# Altium schematic sheet Sheet1.SchDoc
size C; SheetNumber: 1; SheetTotal: 1
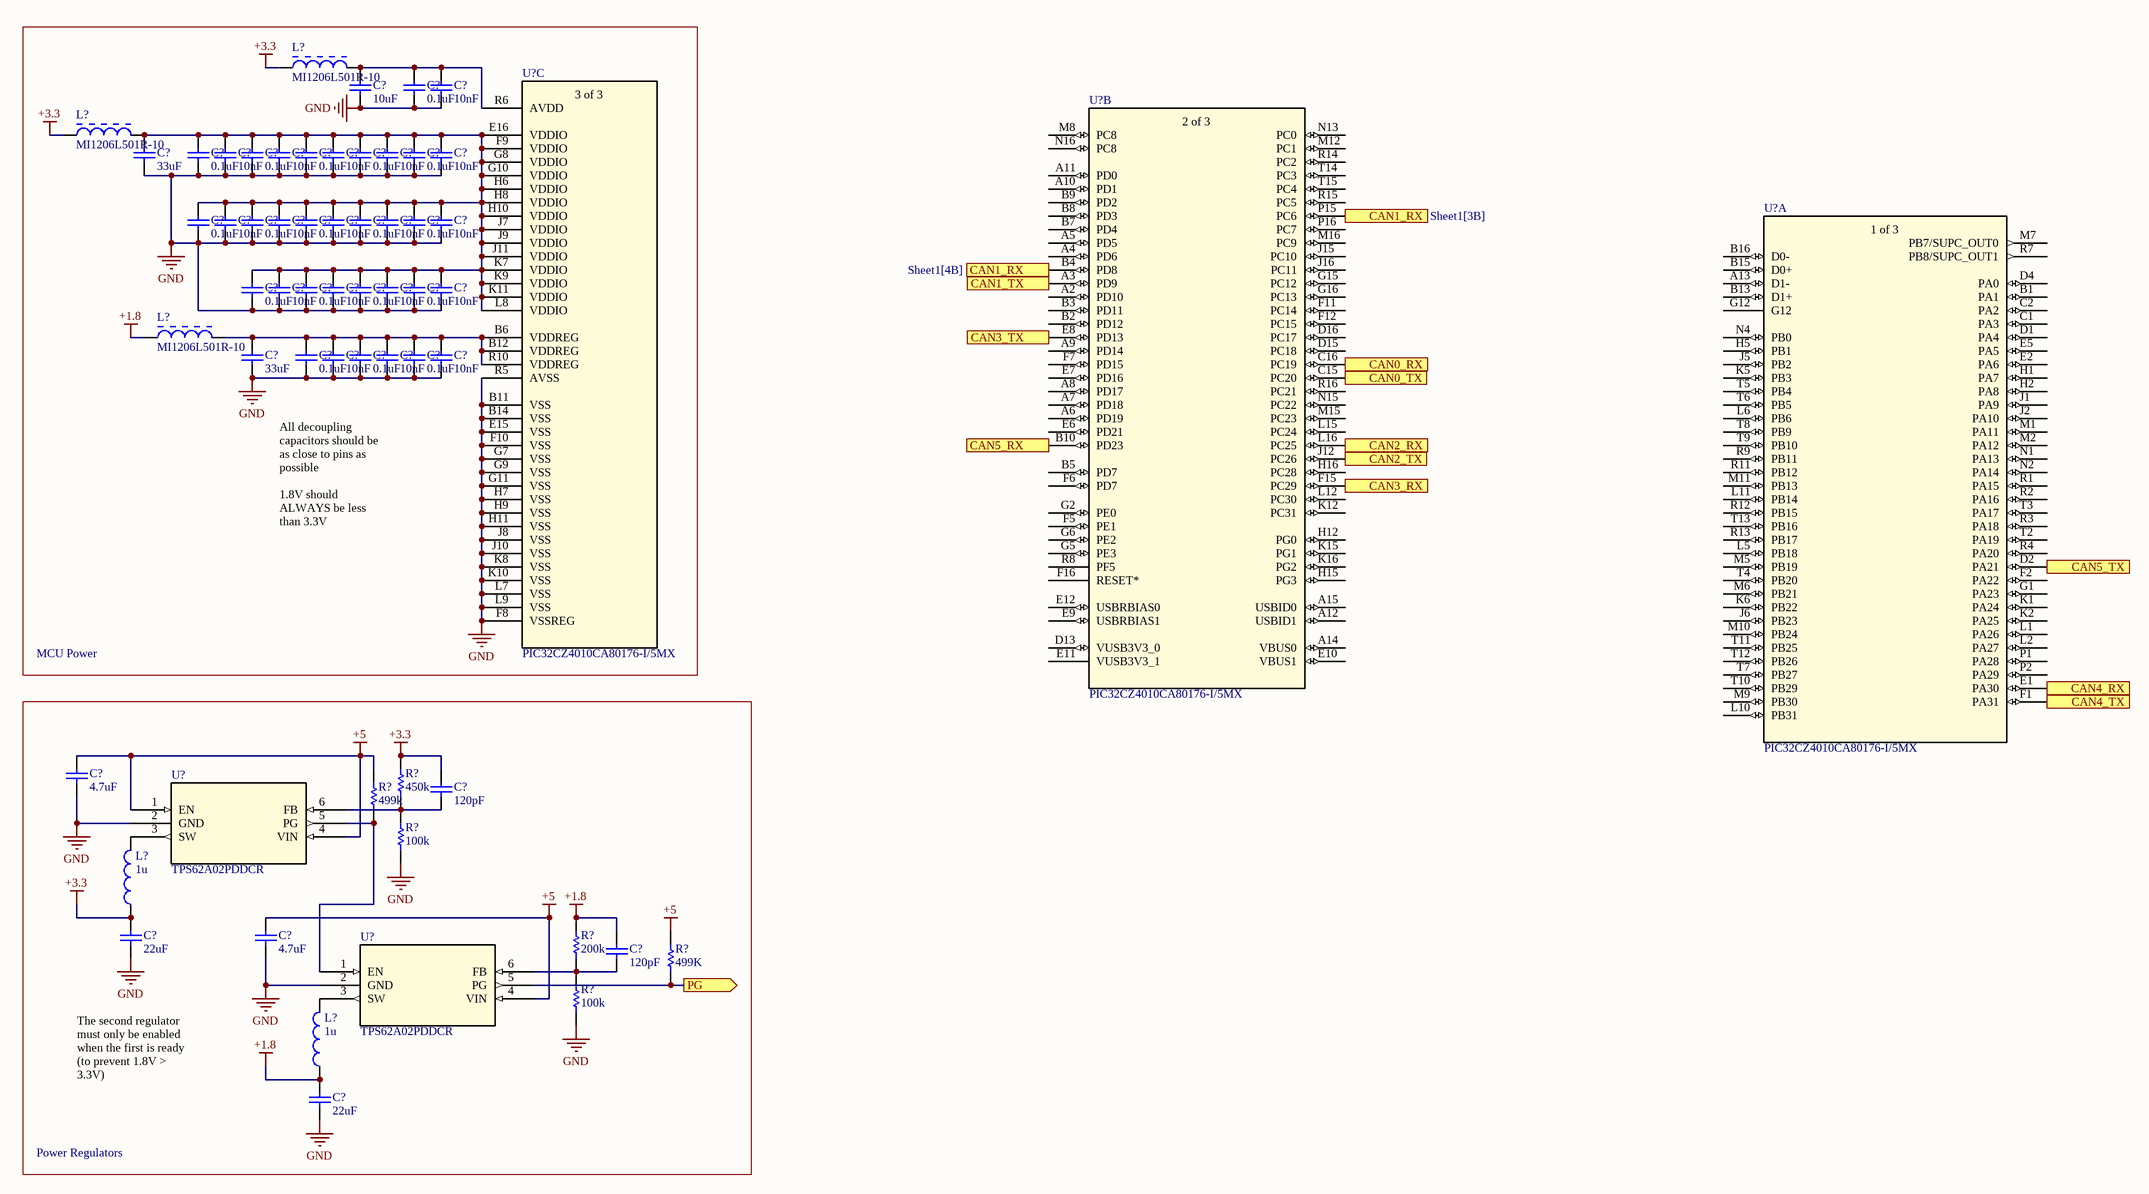
[diagram p0: Sheet1.SchDoc]

## Parts
(Parts that share a designator on the sheet are numbered #1, #2 ... from top to bottom, then left to right.)
C?#1  value 0.1uF  (hidden comment: Capacitor)
C?#2  value 10nF  (hidden comment: Capacitor)
C?#3  value 10uF  (hidden comment: Capacitor)
C?#4  value 0.1uF  (hidden comment: Capacitor)
C?#5  value 10nF  (hidden comment: Capacitor)
C?#6  value 0.1uF  (hidden comment: Capacitor)
C?#7  value 10nF  (hidden comment: Capacitor)
C?#8  value 0.1uF  (hidden comment: Capacitor)
C?#9  value 10nF  (hidden comment: Capacitor)
C?#10  value 0.1uF  (hidden comment: Capacitor)
C?#11  value 10nF  (hidden comment: Capacitor)
C?#12  value 0.1uF  (hidden comment: Capacitor)
C?#13  value 10nF  (hidden comment: Capacitor)
C?#14  value 33uF  (hidden comment: Capacitor)
C?#15  value 0.1uF  (hidden comment: Capacitor)
C?#16  value 10nF  (hidden comment: Capacitor)
C?#17  value 0.1uF  (hidden comment: Capacitor)
C?#18  value 10nF  (hidden comment: Capacitor)
C?#19  value 0.1uF  (hidden comment: Capacitor)
C?#20  value 10nF  (hidden comment: Capacitor)
C?#21  value 0.1uF  (hidden comment: Capacitor)
C?#22  value 10nF  (hidden comment: Capacitor)
C?#23  value 0.1uF  (hidden comment: Capacitor)
C?#24  value 10nF  (hidden comment: Capacitor)
C?#25  value 0.1uF  (hidden comment: Capacitor)
C?#26  value 10nF  (hidden comment: Capacitor)
C?#27  value 0.1uF  (hidden comment: Capacitor)
C?#28  value 10nF  (hidden comment: Capacitor)
C?#29  value 0.1uF  (hidden comment: Capacitor)
C?#30  value 10nF  (hidden comment: Capacitor)
C?#31  value 0.1uF  (hidden comment: Capacitor)
C?#32  value 10nF  (hidden comment: Capacitor)
C?#33  value 33uF  (hidden comment: Capacitor)
C?#34  value 0.1uF  (hidden comment: Capacitor)
C?#35  value 10nF  (hidden comment: Capacitor)
C?#36  value 0.1uF  (hidden comment: Capacitor)
C?#37  value 10nF  (hidden comment: Capacitor)
C?#38  value 0.1uF  (hidden comment: Capacitor)
C?#39  value 10nF  (hidden comment: Capacitor)
C?#40  value 4.7uF  (hidden comment: Capacitor)
C?#41  value 120pF  (hidden comment: Capacitor)
C?#42  value 22uF  (hidden comment: Capacitor)
C?#43  value 4.7uF  (hidden comment: Capacitor)
C?#44  value 120pF  (hidden comment: Capacitor)
C?#45  value 22uF  (hidden comment: Capacitor)
L?#1  MI1206L501R-10  [LIRD-HI1206T500R-10_V]
L?#2  MI1206L501R-10  [LIRD-HI1206T500R-10_V]
L?#3  MI1206L501R-10  [LIRD-HI1206T500R-10_V]
L?#4  value 1u  (hidden comment: Inductor)
L?#5  value 1u  (hidden comment: Inductor)
R?#1  value 450k  (hidden comment: Resistor)
R?#2  value 499k  (hidden comment: Resistor)
R?#3  value 100k  (hidden comment: Resistor)
R?#4  value 200k  (hidden comment: Resistor)
R?#5  value 499K  (hidden comment: Resistor)
R?#6  value 100k  (hidden comment: Resistor)
U?#1  PIC32CZ4010CA80176-I/5MX  [BGA_PIC32CZ4010CA80176-I5MX_MCH]  (part C of 3)
U?#2  PIC32CZ4010CA80176-I/5MX  [BGA_PIC32CZ4010CA80176-I5MX_MCH]  (part B of 3)
U?#3  PIC32CZ4010CA80176-I/5MX  [BGA_PIC32CZ4010CA80176-I5MX_MCH]  (part A of 3)
U?#4  TPS62A02PDDCR  [SOT-23-THIN-6_DDC_TEX]
U?#5  TPS62A02PDDCR  [SOT-23-THIN-6_DDC_TEX]

## Blocks framed on the sheet
MCU Power: C?#1-C?#39 L?#1-L?#3 U?#1
Power Regulators: C?#40-C?#45 L?#4 L?#5 R?#1-R?#6 U?#4 U?#5

## Ports
CAN0_RX (in), CAN0_TX (out), CAN1_RX (in, see Sheet1[3B]), CAN1_RX (in, see Sheet1[4B]), CAN1_TX (out), CAN2_RX (in), CAN2_TX (out), CAN3_RX (in), CAN3_TX (out), CAN4_RX (in), CAN4_TX (out), CAN5_RX (in), CAN5_TX (out), PG (out)

## Nets
+1.8: C?#44.2 C?#45.2 L?#3.1 L?#5.1 R?#4.1
+3.3: C?#41.2 C?#42.2 L?#1.1 L?#2.1 L?#4.1 R?#1.1
+5: C?#40.2 C?#43.2 R?#2.2 R?#5.2 U?#4.1(EN) U?#4.4(VIN) U?#5.4(VIN)
GND: C?#1.2 C?#2.2 C?#3.1 C?#4.2 C?#5.2 C?#6.2 C?#7.2 C?#8.2 C?#9.2 C?#10.2 C?#11.2 C?#12.2 C?#13.2 C?#14.1 C?#15.2 C?#16.2 C?#17.2 C?#18.2 C?#19.2 C?#20.2 C?#21.2 C?#22.2 C?#23.2 C?#24.2 C?#25.2 C?#26.2 C?#27.2 C?#28.2 C?#29.2 C?#30.2 C?#31.2 C?#32.2 C?#33.2 C?#34.2 C?#35.2 C?#36.2 C?#37.2 C?#38.2 C?#39.2 C?#40.1 C?#42.1 C?#43.1 C?#45.1 R?#3.1 R?#6.1 U?#1.B11(VSS) U?#1.B14(VSS) U?#1.E15(VSS) U?#1.F8(VSSREG) U?#1.F10(VSS) U?#1.G7(VSS) U?#1.G9(VSS) U?#1.G11(VSS) U?#1.H7(VSS) U?#1.H9(VSS) U?#1.H11(VSS) U?#1.J8(VSS) U?#1.J10(VSS) U?#1.K8(VSS) U?#1.K10(VSS) U?#1.L7(VSS) U?#1.L9(VSS) U?#1.R5(AVSS) U?#4.2(GND) U?#5.2(GND)
CAN0_RX: U?#2.C16(PC19) ; port CAN0_RX
CAN0_TX: U?#2.C15(PC20) ; port CAN0_TX
CAN1_RX: U?#2.B4(PD8) U?#2.P15(PC6) ; port CAN1_RX
CAN1_TX: U?#2.A3(PD9) ; port CAN1_TX
CAN2_RX: U?#2.L16(PC25) ; port CAN2_RX
CAN2_TX: U?#2.J12(PC26) ; port CAN2_TX
CAN3_RX: U?#2.F15(PC29) ; port CAN3_RX
CAN3_TX: U?#2.E8(PD13) ; port CAN3_TX
CAN4_RX: U?#3.E1(PA30) ; port CAN4_RX
CAN4_TX: U?#3.F1(PA31) ; port CAN4_TX
CAN5_RX: U?#2.B10(PD23) ; port CAN5_RX
CAN5_TX: U?#3.D2(PA21) ; port CAN5_TX
PG: R?#5.1 U?#5.5(PG) ; port PG
NetC?#1_1: C?#1.1 C?#2.1 C?#3.2 L?#1.2 U?#1.R6(AVDD)
NetC?#4_1: C?#4.1 C?#5.1 C?#6.1 C?#7.1 C?#8.1 C?#9.1 C?#10.1 C?#11.1 C?#12.1 C?#13.1 C?#14.2 C?#15.1 C?#16.1 C?#17.1 C?#18.1 C?#19.1 C?#20.1 C?#21.1 C?#22.1 C?#23.1 C?#24.1 C?#25.1 C?#26.1 C?#27.1 C?#28.1 C?#29.1 C?#30.1 C?#31.1 C?#32.1 L?#2.2 U?#1.E16(VDDIO) U?#1.F9(VDDIO) U?#1.G8(VDDIO) U?#1.G10(VDDIO) U?#1.H6(VDDIO) U?#1.H8(VDDIO) U?#1.H10(VDDIO) U?#1.J7(VDDIO) U?#1.J9(VDDIO) U?#1.J11(VDDIO) U?#1.K7(VDDIO) U?#1.K9(VDDIO) U?#1.K11(VDDIO) U?#1.L8(VDDIO)
NetC?#33_1: C?#33.1 C?#34.1 C?#35.1 C?#36.1 C?#37.1 C?#38.1 C?#39.1 L?#3.2 U?#1.B6(VDDREG) U?#1.B12(VDDREG) U?#1.R10(VDDREG)
NetC?#41_1: C?#41.1 R?#1.2 R?#3.2 U?#4.6(FB)
NetC?#44_1: C?#44.1 R?#4.2 R?#6.2 U?#5.6(FB)
NetL?#4_2: L?#4.2 U?#4.3(SW)
NetL?#5_2: L?#5.2 U?#5.3(SW)
NetR?#2_1: R?#2.1 U?#4.5(PG) U?#5.1(EN)

Not connected (* = marked no-connect by the designer): U?#2 A2(PD10) A4(PD6) A5(PD5) A6(PD19) A7(PD18) A8(PD17) A9(PD14) A10(PD1) A11(PD0) A12(USBID1) A14(VBUS0) A15(USBID0) B2(PD12) B3(PD11) B5(PD7) B7(PD4) B8(PD3) B9(PD2) D13(VUSB3V3_0) D15(PC18) D16(PC17) E6(PD21) E7(PD16) E9(USBRBIAS1) E10(VBUS1) E11(VUSB3V3_1) E12(USBRBIAS0) F5(PE1) F6(PD7) F7(PD15) F11(PC14) F12(PC15) F16(RESET*) G2(PE0) G5(PE3) G6(PE2) G15(PC12) G16(PC13) H12(PG0) H15(PG3) H16(PC28) J15(PC10) J16(PC11) K12(PC31) K15(PG1) K16(PG2) L12(PC30) L15(PC24) M8(PC8) M12(PC1) M15(PC23) M16(PC9) N13(PC0) N15(PC22) N16(PC8) P16(PC7) R8(PF5) R14(PC2) R15(PC5) R16(PC21) T14(PC3) T15(PC4); U?#3 A13(D1-) B1(PA1) B13(D1+) B15(D0+) B16(D0-) C1(PA3) C2(PA2) D1(PA4) D4(PA0) E2(PA6) E5(PA5) F2(PA22) G1(PA23) G12 H1(PA7) H2(PA8) H5(PB1) J1(PA9) J2(PA10) J5(PB2) J6(PB23) K1(PA24) K2(PA25) K5(PB3) K6(PB22) L1(PA26) L2(PA27) L5(PB18) L6(PB6) L10(PB31) L11(PB14) M1(PA11) M2(PA12) M5(PB19) M6(PB21) M7(PB7/SUPC_OUT0) M9(PB30) M10(PB24) M11(PB13) N1(PA13) N2(PA14) N4(PB0) P1(PA28) P2(PA29) R1(PA15) R2(PA16) R3(PA18) R4(PA20) R7(PB8/SUPC_OUT1) R9(PB11) R11(PB12) R12(PB15) R13(PB17) T2(PA19) T3(PA17) T4(PB20) T5(PB4) T6(PB5) T7(PB27) T8(PB9) T9(PB10) T10(PB29) T11(PB25) T12(PB26) T13(PB16)

## Notes on the sheet
- All decoupling capacitors should be as close to pins as possible
  1.8V should ALWAYS be less than 3.3V
- The second regulator must only be enabled when the first is ready (to prevent 1.8V > 3.3V)
- (in symbol PIC32CZ4010CA80176-I5MX, part A) 1 of 3
- (in symbol PIC32CZ4010CA80176-I5MX, part B) 2 of 3
- (in symbol PIC32CZ4010CA80176-I5MX, part C) 3 of 3

## Library data of the parts
C?#1-C?#45 = Capacitor: SimulationGenericComponent: True
L?#1-L?#3 = CMP-2000-06703-1: Chip Bead, 100 MHz, 2 A, -40 to 125 degC, 2-Pin SMD (1206), RoHS, Tape and Reel; Manufacturer: Laird; Impedance @ Frequency: 500Ohm@100MHz; Catalog Drawings: (HI,HZ,LF,LI,MI)1206Series_1.30mmMax.Height; Online Catalog: MISeries; Kits: 240-2227-ND-KITEMIFERRITEBEADCHIPSMD; Filter Type: PowerLine; Current Rating (Max): 2A; DC Resistance (DCR) (Max): 60mOhm; Number of Lines: 1; Other Names: 240-2407-1; Series: MI; Ratings: -; Category: Filters; Package / Case: 1206(3216Metric); Packaging: CutTape(CT); Mounting Type: SurfaceMount; Standard Package: 1; Manufacturer URL: https://www.lairdtech.com/; Package Description: 2-Pin Surface Mount Device, Body 3.2 x 1.6 mm; Datasheet Version: Rev. E, 08/2013; Size / Dimension: 0.126"Lx0.063"W(3.20mmx1.60mm); Height (Max): 0.051"(1.30mm); Mounting Technology: SurfaceMount; Datasheet URL: http://cdn.lairdtech.com/home/brandworld/files/MI1206L501R-10.pdf; Family: FerriteBeadsandChips; Operating Temperature: -40°C~125°C; Package Reference: HI1206T500R-10
L?#4 L?#5 = Inductor: SimulationGenericComponent: True
R?#1-R?#6 = Resistor: TC1: 0; SimulationGenericComponent: True; TC2: 0
U?#1-U?#3 = PIC32CZ4010CA80176-I5MX: No Description Available; Manufacturer_Name: Microchip; Copyright: Copyright (C) 2025 Ultra Librarian. All rights reserved.; Manufacturer_Part_Number: PIC32CZ4010CA80176-I/5MX; RefDes: RefDes; Type: Type
U?#4 U?#5 = TPS62A02PDDCR: 2.5V to 5.5V input, 2A high-efficiency step-down converter in SOT563 and SOT23 packages 6-SOT-23-THIN -40 to 125; Manufacturer_Name: Texas Instruments; Type: Power Management; Copyright: Copyright (C) 2025 Ultra Librarian. All rights reserved.; Manufacturer_Part_Number: TPS62A02PDDCR; Datasheet: https://www.ti.com/lit/gpn/tps62a02; RefDes: RefDes